# EAGLE design usbB_4pin (EAGLE 6.4)
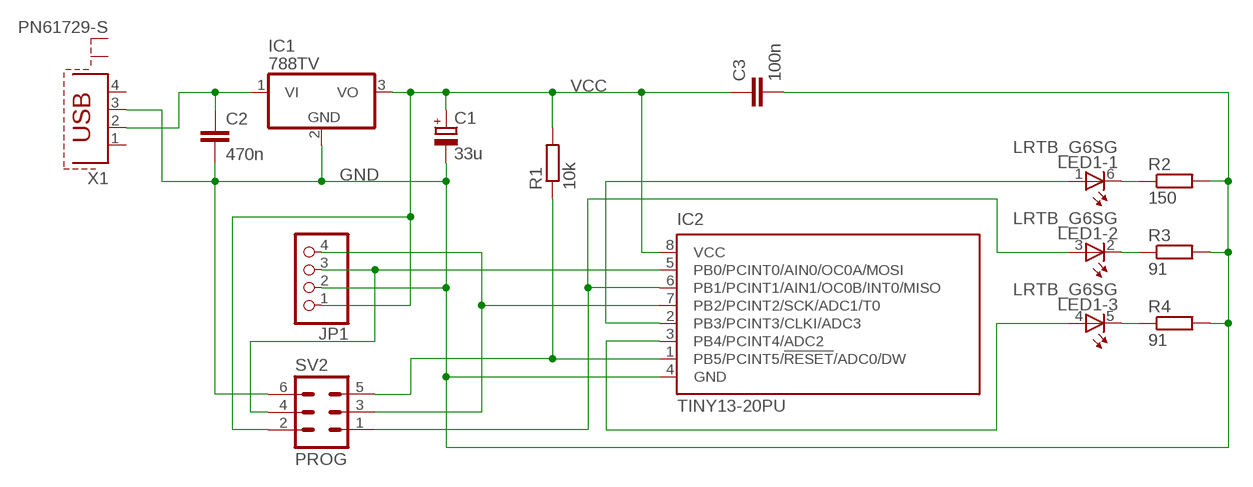
[diagram p0: schematic, sheet 1]

## Parts
C1  33u  CPOL-EUE2,5-6E  [E2,5-6E]
C2  470n  C-EU050-025X075  [C050-025X075]
C3  100n  C-EU050-025X075  [C050-025X075]
IC1  788TV  [TO220V]
IC2  TINY13-20PU  [DIL08]
JP1  PINHD-1X4  [1X04]
LED1  LRTB_G6SG  [LRTB_G6SG]
R1  10k  R-EU_0204/7  [0204/7]
R2  150  R-EU_0204/7  [0204/7]
R3  91  R-EU_0204/7  [0204/7]
R4  91  R-EU_0204/7  [0204/7]
SV2  PROG  ML6  [ML6]
X1  PN61729-S  [PN61729-S]

## Nets
_RESET: IC2.1(PB5/PCINT5/!RESET!/ADC0/DW) R1.1 SV2.5
GND: C1.- C2.2 C3.2 IC1.2(GND) IC2.4(GND) JP1.2 R2.2 R3.2 R4.2 SV2.6 X1.3
MISO: IC2.6(PB1/PCINT1/AIN1/OC0B/INT0/MISO) LED1.3(-2:A) SV2.1
N$1: C2.1 IC1.1(VI) X1.2
N$3: IC2.2(PB3/PCINT3/CLKI/ADC3) LED1.1(-1:A)
N$6: LED1.5(-3:C) R4.1
N$7: LED1.2(-2:C) R3.1
N$8: LED1.6(-1:C) R2.1
N$9: IC2.3(PB4/PCINT4/ADC2) LED1.4(-3:A)
N$10: IC2.5(PB0/PCINT0/AIN0/OC0A/MOSI) JP1.3 SV2.4
SCK: IC2.7(PB2/PCINT2/SCK/ADC1/T0) JP1.4 SV2.3
VCC: C1.+ C3.1 IC1.3(VO) IC2.8(VCC) JP1.1 R1.2 SV2.2
Unconnected: X1.1 X1.4 X1.S1 X1.S2

## Library data of the parts
C1 = rcl:CPOL-EU: POLARIZED CAPACITOR, European symbol
C2 C3 = rcl:C-EU: CAPACITOR, European symbol
IC1 = linear:78*: Positive VOLTAGE REGULATOR Source: http://cache.national.com/ds/LM/LM78L05.pdf http://www.fairchildsemi.com/ds/LM/LM7805.pdf
IC2 = atmel:TINY13: 8-bit AVR Microcontroller with 1K Bytes In-System Programmable Flash Source: http://www.atmel.com/dyn/resources/prod_documents/2535S.pdf; MPN: ATTINY13-20PU; OC_FARNELL: 9171550; OC_NEWARK: 96K6521
JP1 = pinhead:PINHD-1X4: PIN HEADER
LED1 = led:LRTB_G6SG: LRTB G6SG 6-lead TOPLED® Source: OSRAM Opto Semiconductors ... LRTB_G6SG_Pb_free.pdf
R1-R4 = resistor:R-EU_: RESISTOR, European symbol
SV2 = con-ml:ML6: HARTING; OC_FARNELL: unknown; OC_NEWARK: unknown
X1 = con-berg:PN61729-S: BERG USB connector; OC_FARNELL: unknown; OC_NEWARK: unknown

## Board
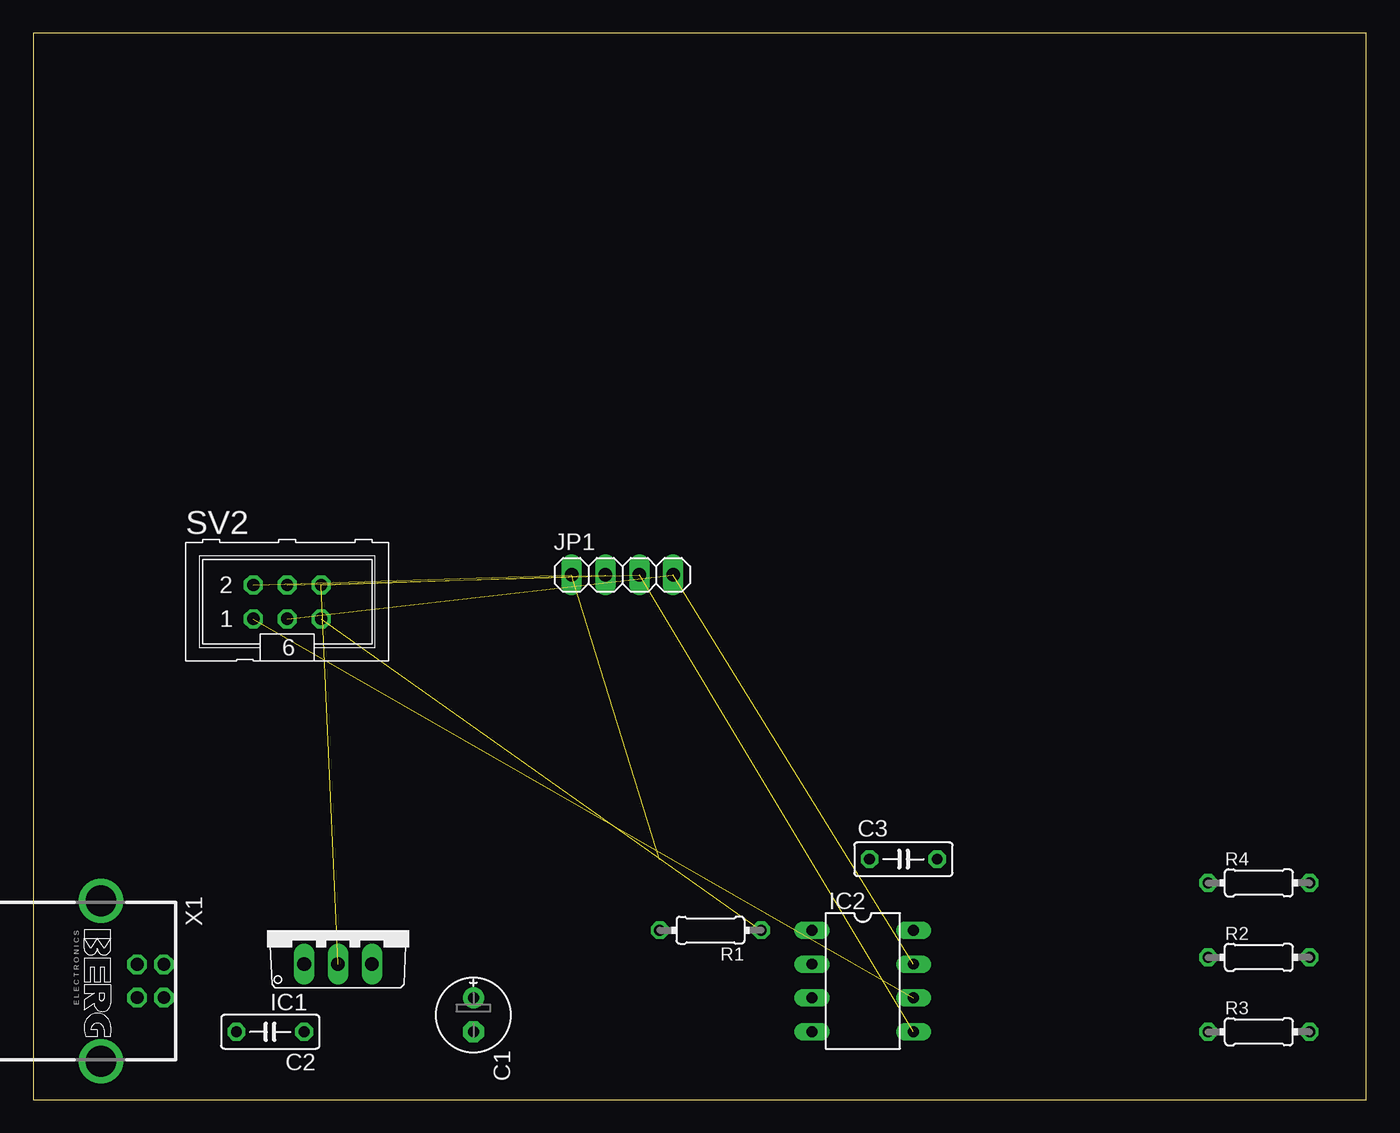
[diagram p1: board, top side]
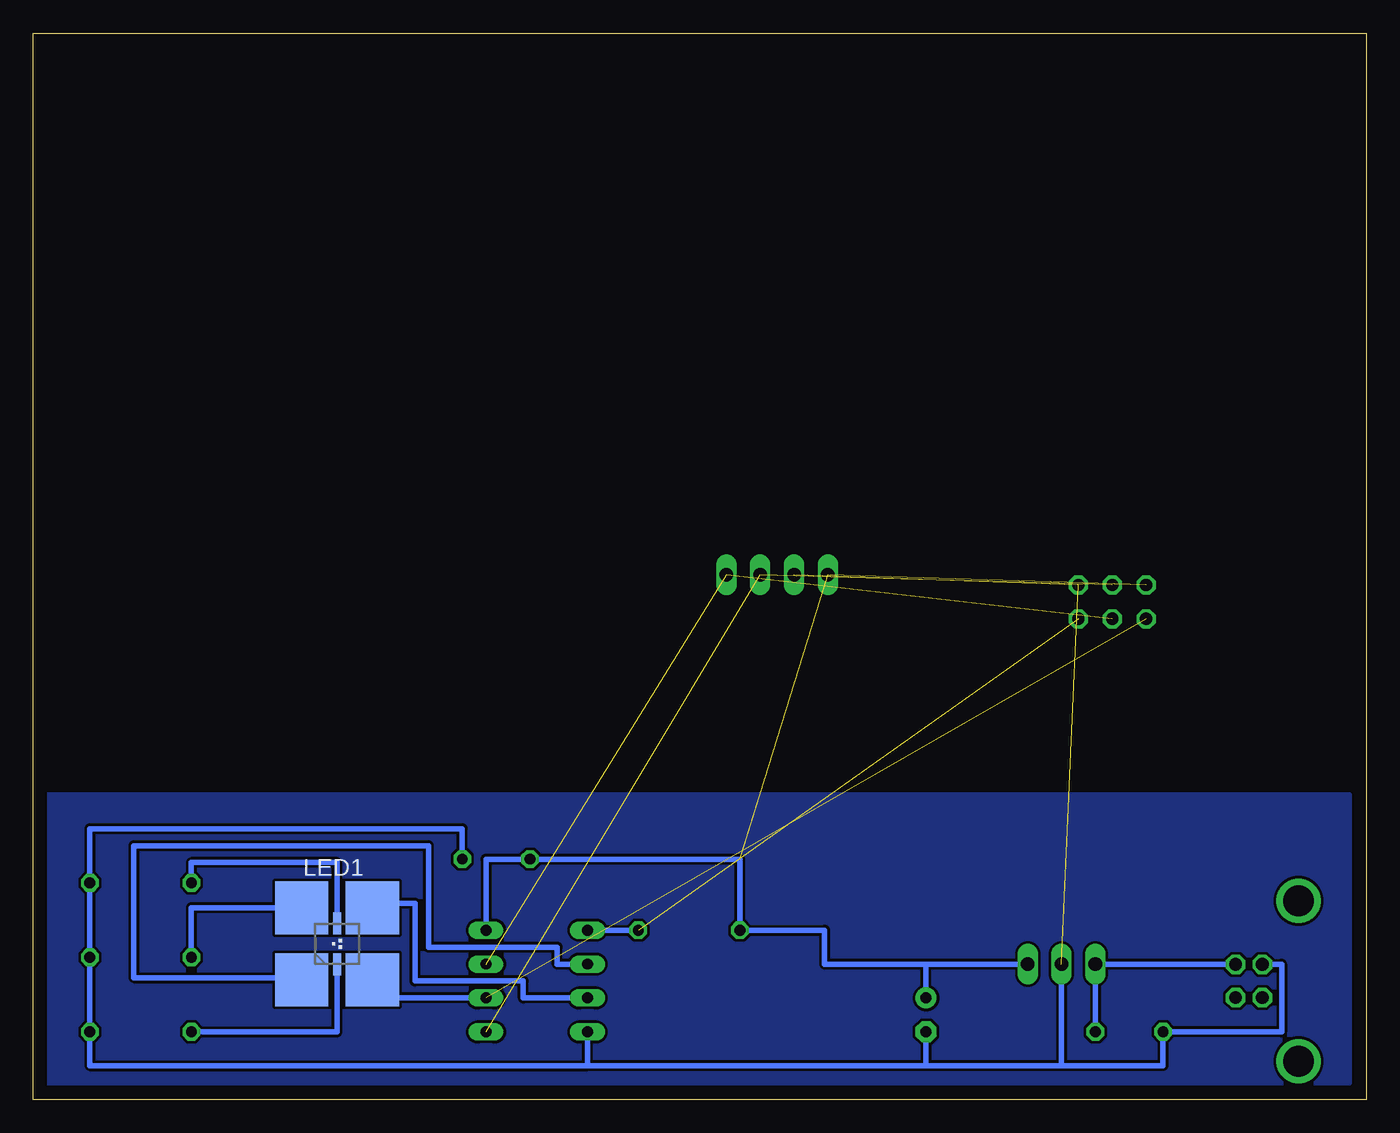
[diagram p2: board, bottom side, seen from below]

Size 100 x 80 mm. Coordinates in mm from the lower left corner, seen from the top.
Outline: 0,0 100,0 100,80 0,80 0,0
Copper layers (1*16): Top 0.035mm / dielectric 1.5mm / Bottom 0.035mm
Design rules "default": minimum track width 10mil, minimum drill 24mil, track to track 8mil, track to pad 8mil, pad to pad 8mil, via to via 8mil, smd to smd 8mil, copper to edge 40mil, drill to drill 8mil, minimum pad ring 10mil, minimum via ring 8mil, stop-mask expansion 4mil, vias tented up to drill 0mil, thermal gap 10mil

### Footprints (pad centres in the part's own frame; a part is rotated, then mirrored left to right if it is on the bottom)
E2,5-6E = drill 0.813 pad 1.575: + -1.27,0 | drill 0.813 pad 1.575 octagon: - 1.27,0
C050-025X075 = drill 0.813 octagon: 1 -2.54,0; 2 2.54,0
TO220V = drill 1.016 long: 1 -2.54,-2.54; 2 0,-2.54; 3 2.54,-2.54
DIL08 = drill 0.813 long: 1 -3.81,-3.81; 2 -1.27,-3.81; 3 1.27,-3.81; 4 3.81,-3.81; 5 3.81,3.81; 6 1.27,3.81; 7 -1.27,3.81; 8 -3.81,3.81
1X04 = drill 1.016 long: 1 -3.81,0; 2 -1.27,0; 3 1.27,0; 4 3.81,0
LRTB_G6SG = smd 4 x 4: 1 -2.65,-2.7; 3 2.65,-2.7; 4 2.65,2.7; 6 -2.65,2.7 | smd 0.6 x 1.65: 2 0,-1.525; 5 0,1.525
0204/7 = drill 0.813 octagon: 1 -3.81,0; 2 3.81,0
ML6 = drill 0.914 octagon: 1 -2.54,-1.27; 2 -2.54,1.27; 3 0,-1.27; 4 0,1.27; 5 2.54,-1.27; 6 2.54,1.27
PN61729-S = drill 0.95 octagon: 1 1.25,4.71; 2 -1.25,4.71; 3 -1.25,2.71; 4 1.25,2.71 | drill 2.3 pad 2.9: S1 -6.02,0; S2 6.02,0

### Placement (x,y rotation side)
C1  33.02,6.35 270 top
C2  17.78,5.08 180 top
C3  65.28,18.03 0 top
IC1  22.86,12.7 0 top
IC2  62.23,8.89 270 top
JP1  44.2,39.37 0 top
LED1  77.22,11.68 0 bottom
R1  50.8,12.7 180 top
R2  91.95,10.67 0 top
R3  91.95,5.08 0 top
R4  91.95,16.26 0 top
SV2  19.05,37.34 0 top
X1  5.08,8.89 270 top

### Tracks (layer width: path | path; a pad name or v marks a point on that pad's centre or on a via)
_RESET  (1 unrouted)
  Bottom 0.406: IC2.1 R1.1
GND  (2 unrouted)
  Bottom 0.406: X1.3 6.35,10.14 | 6.35,10.14 6.35,10.16 | 6.35,10.14 6.35,5.08 C2.2 15.24,2.54 22.86,2.54 | IC1.2 22.86,2.54 | 22.86,2.54 33.02,2.54 | C1.- 33.02,2.54 | 58.42,2.54 95.76,2.54 R3.2 R2.2 R4.2 95.76,20.32 67.82,20.32 C3.2 | 58.42,2.54 IC2.4 | 33.02,2.54 58.42,2.54
MISO  (1 unrouted)
  Bottom 0.406: IC2.6 74.57,7.62 LED1.3
N$1
  Bottom 0.406: X1.2 20.32,10.14 IC1.1 C2.1
N$2
  pour Bottom: 99.06,1.27 99.06,22.86 20.32,22.86 1.27,22.86 1.27,1.27
N$3
  Bottom 0.406: IC2.2 60.71,10.16 60.71,11.43 70.36,11.43 70.36,19.05 92.46,19.05 92.46,9.14 79.87,9.14 LED1.1
N$6
  Bottom 0.406: LED1.5 77.22,17.78 88.14,17.78 R4.1
N$7
  Bottom 0.406: R3.1 77.22,5.08 LED1.2
N$8
  Bottom 0.406: LED1.6 88.14,14.38 R2.1
N$9
  Bottom 0.406: IC2.3 63.25,7.62 63.25,8.89 71.37,8.89 71.37,14.73 74.57,14.73 LED1.4
N$10  (2 unrouted)
SCK  (2 unrouted)
VCC  (2 unrouted)
  Bottom 0.406: IC1.3 33.02,10.16 | C1.+ 33.02,10.16 | 33.02,10.16 40.64,10.16 40.64,12.7 R1.2 46.99,18.03 C3.1 66.04,18.03 IC2.8